# Altium project sheme.PrjPcb
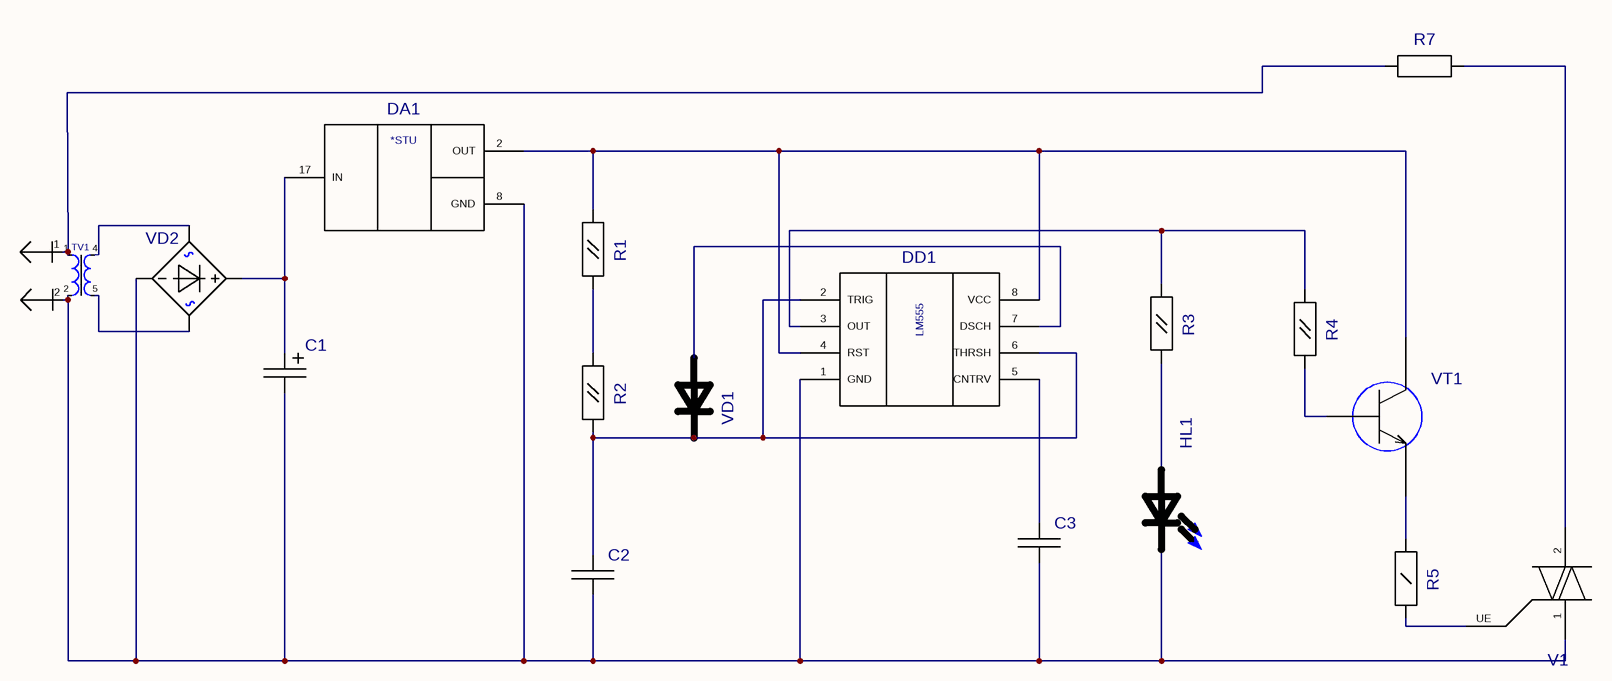
[diagram p0: Sheet1.SCHDOC]
1 sheet, 18 parts. Net scope: global (net labels, ports and power ports of the same name join across sheets).

## Sheet Sheet1.SCHDOC
size 420 x 297 mm; SheetNumber: 1; SheetTotal: 1; DocumentName: Sheet1.SCHDOC

### Parts
C1  K534A-4  [K534A-4]  (value not drawn)
C2  CC1812  [CC1812]  (value not drawn)
C3  CC1812  [CC1812]  (value not drawn)
DA1  КР142ЕН5А  [TO-220-KT-28-2]  (value not drawn)
DD1  LM555CM  [SO-8]  (value not drawn)
HL1  3528  [3528]  (value not drawn)
R1  C2-33H-0.125W_OLD_UGO  [C2-33H-0.125W]  (value not drawn)
R2  C2-33H-0.125W_OLD_UGO  [C2-33H-0.125W]  (value not drawn)
R3  C2-33H-0.125W_OLD_UGO  [C2-33H-0.125W]  (value not drawn)
R4  C2-33H-0.125W_OLD_UGO  [C2-33H-0.125W]  (value not drawn)
R5  C2-33H-0.25W_OLD_UGO  [C2-33H-0.25W]  (value not drawn)
R7  C2-33Н-0.125W_10ММ  [C2-33H-0.125W_10MM]  (value not drawn)
TV1  A1401  [TRS-3-1]  (value not drawn)
V1  TC122  [TC122]  (value not drawn)
VD1  1N34  [DO-7]  (value not drawn)
VD2  RS402L  [RS-4L]  (value not drawn)
VT1  2N5551S  [SOT-23]  (value not drawn)
X1  CAN9V-1  [CAN9V]  (value not drawn)  (parts A,B of 9)

### Nets
NetC1_1: C1.1(I/OA) DA1.17(IN) VD2.1(+)
NetC1_2: C1.2(I/OB) C2.2 C3.2 DA1.8(GND) DD1.1(GND) HL1.K TV1.2 V1.1(E2) VD2.4(-) X1.2(i/o)
NetC2_1: C2.1 DD1.2(TRIG) DD1.6(THRSH) R2.2 VD1.K
NetC3_1: C3.1 DD1.5(CNTRV)
NetDA1_2: DA1.2(OUT) DD1.4(RST) DD1.8(VCC) R1.1 VT1.3(K)
NetDD1_3: DD1.3(OUT) R3.1 R4.1
NetDD1_7: DD1.7(DSCH) VD1.A
NetHL1_A: HL1.A R3.2
NetR1_2: R1.2 R2.1
NetR4_2: R4.2 VT1.2(B)
NetR5_1: R5.1 VT1.1(E)
NetR5_2: R5.2 V1.UE
NetR7_1: R7.1 TV1.1 X1.1(i/o)
NetR7_2: R7.2 V1.2(E1)
NetTV1_4: TV1.4 VD2.2
NetTV1_5: TV1.5 VD2.3

Not connected (* = marked no-connect by the designer): DA1 4; TV1 3 6 7 8; V1 4 5

### Notes on the sheet
- (in symbol LM555CM) LM555
- (in symbol КР142ЕН5А) *STU

### Library data of the parts
C1 = K534A-4: PDIF_TY: 11245; Value: *
R1-R4 = C2-33H-0.125W_OLD_UGO: Autor: pcbdesigner.ru; Value: *
R5 = C2-33H-0.25W_OLD_UGO: Autor: pcbdesigner.ru; Value: *
C2 C3 = CC1812: Value: *
DA1 = КР142ЕН5А: Value: *
DD1 = LM555CM: Value: *
R7 = C2-33Н-0.125W_10ММ: Value: *
TV1 = A1401: Value: *
V1 = TC122: Value: *
VD1 = 1N34: Value: *
VD2 = RS402L: Value: *
VT1 = 2N5551S: Value: *
X1 = CAN9V-1: Value: *